# Altium project console_mainboard.PrjPcb
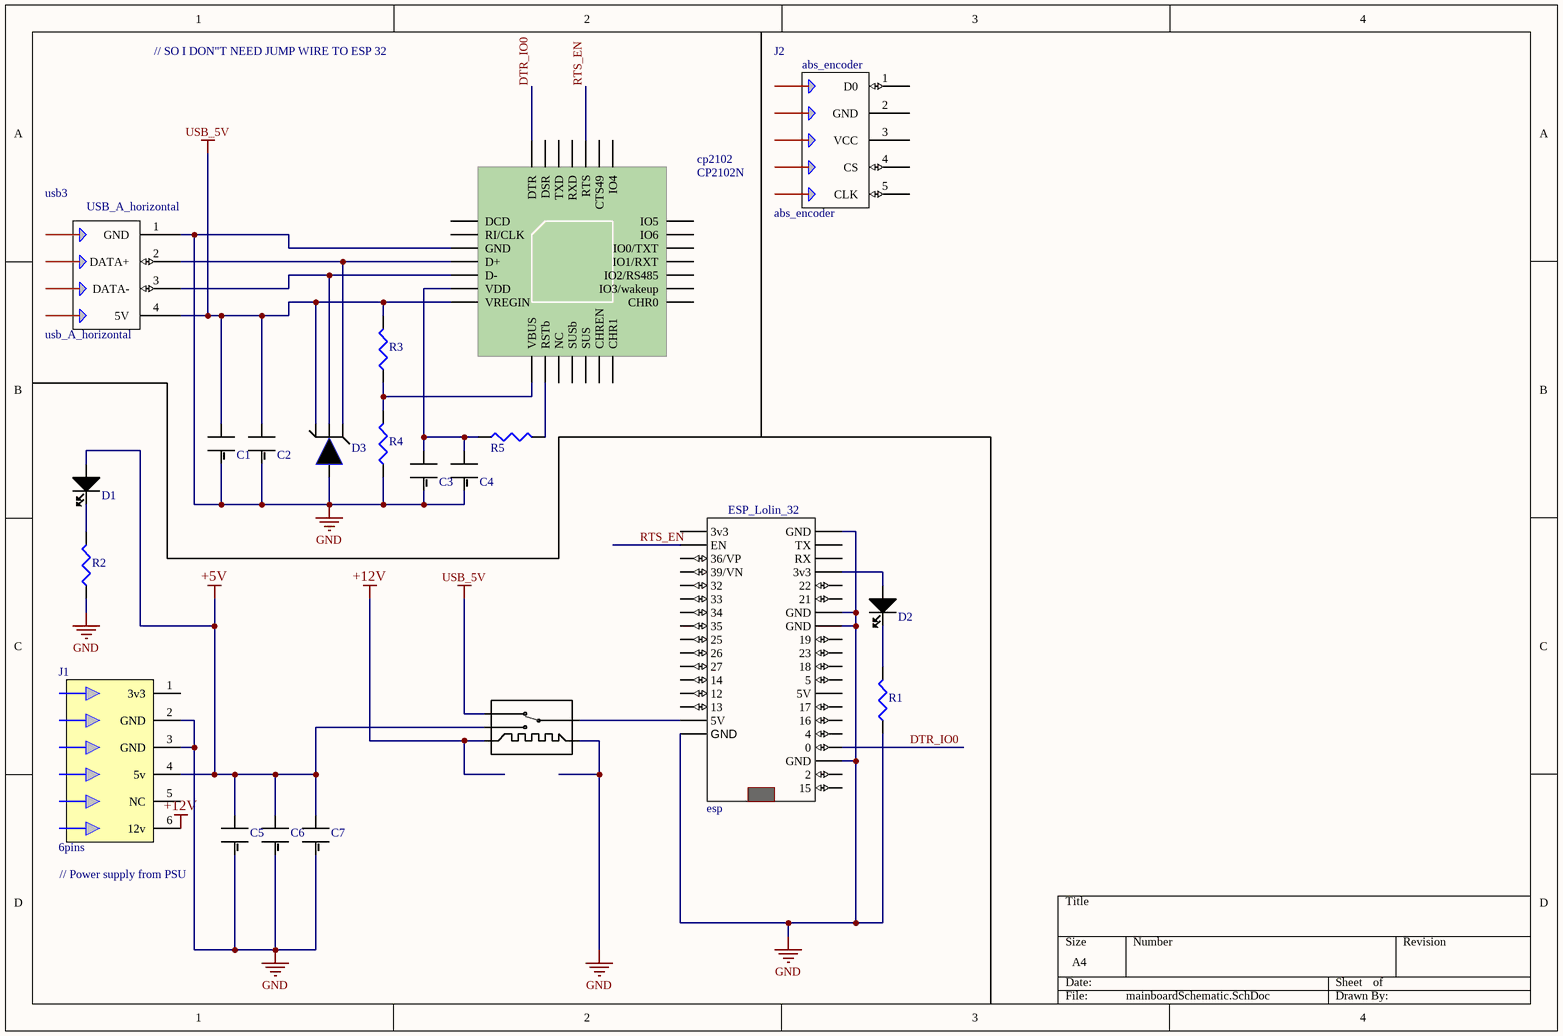
[diagram p0: mainboardSchematic.SchDoc]
1 sheet, 21 parts. Net scope: global (net labels, ports and power ports of the same name join across sheets).
Board file: MainFuckingBoard.PcbDoc

## Sheet mainboardSchematic.SchDoc
size A4

### Parts
C1  capacitor0603  [Capacitor0603]  (value not drawn)
C2  capacitor0603  [Capacitor0603]  (value not drawn)
C3  capacitor0603  [Capacitor0603]  (value not drawn)
C4  capacitor0603  [Capacitor0603]  (value not drawn)
C5  EEU-FM0J331  [2.5mmCapacitor]  (value not drawn)
C6  EEU-FM0J331  [2.5mmCapacitor]  (value not drawn)
C7  EEU-FM0J331  [2.5mmCapacitor]  (value not drawn)
cp2102  CP2102N  [CP2102N_QFN28]
D1  Led  [LED0603]  (value not drawn)
D2  Led  [LED0603]  (value not drawn)
D3  SP0503BAHTG  [SP0503BAHTG - SOT143-4]  (value not drawn)
esp  processor  [ESP_32_socket]  (value not drawn)
J1  6pins  [4.2mm 6pin power connector]
J2  abs_encoder  [xh 2.54 5 pin]
R1  360R  [R0805]  (value not drawn)
R2  360R  [R0805]  (value not drawn)
R3  22.1k  [R0805]  (value not drawn)
R4  47.5k  [R0805]  (value not drawn)
R5  1Kohms  [R0805]  (value not drawn)
Relay?  LM1H-12D  [Relay LM1H-12D]  (value not drawn)
usb3  usb_A_horizontal  [HORIZONTAL_USB_A_MALE_SOCKET]

### Nets
+5V: C5.2(+) C6.2(+) C7.2(+) D1.2 J1.4(5v) Relay?.4(NO)
+12V: J1.6(12v) Relay?.1(Coli_A)
GND: C1.1(-) C2.1(-) C3.1(-) C4.1(-) C5.1(-) C6.1(-) C7.1(-) cp2102.3(GND) D3.1(+) esp.1(GND) esp.7(GND) esp.8(GND) esp.18(GND) esp.36(GND) J1.2(GND) J1.3(GND) R1.1 R2.1 R4.1 Relay?.2(Coli_B) usb3.1(GND)
USB_5V: C1.2(+) C2.2(+) cp2102.7(VREGIN) D3.4 R3.2 Relay?.5(NC) usb3.4(5V)
DTR_IO0: cp2102.28(DTR) esp.17(0)
RTS_EN: cp2102.24(RTS) esp.22(EN)
NetC3_2: C3.2(+) C4.2(+) cp2102.6(VDD) R5.1
Netcp2102_4: cp2102.4(D+) D3.2 usb3.2(DATA+)
Netcp2102_5: cp2102.5(D-) D3.3 usb3.3(DATA-)
Netcp2102_8: cp2102.8(VBUS) R3.1 R4.2
Netcp2102_9: cp2102.9(RSTb) R5.2
NetD1_1: D1.1 R2.2
NetD2_1: D2.1 R1.2
NetD2_2: D2.2 esp.4(3v3)
Netesp_35: esp.35(5V) Relay?.3(COM)

Not connected (* = marked no-connect by the designer): cp2102 1(DCD) 2(RI/CLK) 10(NC) 11(SUSb) 12(SUS) 13(CHREN) 14(CHR1) 15(CHR0) 16(IO3/wakeup) 17(IO2/RS485) 18(IO1/RXT) 19(IO0/TXT) 20(IO6) 21(IO5) 22(IO4) 23(CTS49) 25(RXD) 26(TXD) 27(DSR); esp 2(TX) 3(RX) 5(22) 6(21) 9(19) 10(23) 11(18) 12(5) 13(5V) 14(17) 15(16) 16(4) 19(2) 20(15) 21(3v3) 23(36/VP) 24(39/VN) 25(32) 26(33) 27(34) 28(35) 29(25) 30(26) 31(27) 32(14) 33(12) 34(13); J1 1(3v3) 5(NC); J2 1(D0) 2(GND) 3(VCC) 4(CS) 5(CLK)

### Notes on the sheet
- // SO I DON"T NEED JUMP WIRE TO ESP 32
- // Power supply from PSU
- (in symbol ESP_32_lolin) ESP_Lolin_32
- (in symbol usb_A_horizontal) USB_A_horizontal

### Library data of the parts
C1-C4 = capacitor0603: Cap Ceramic 4.7uF 6.3V X5R 20% Pad SMD 0402 85C T/R; Manufacturer 1: Murata; Manufacturer Part Number 1: GRM155R60J475ME87J; Supplier 1: Digi-Key; RoHS: No; Category: Ceramic Capacitors; Stock 1: 206568; Pricing 1: 1=0.16000, 10=0.11100, 50=0.06280, 100=0.05210, 500=0.03654, 1000=0.03025, 2500=0.02815, 5000=0.02575 (USD); Capacitance: 4.7uF; Tolerance: 20%; Dielectric: X5R; Voltage Rating (DC): 6.3V; Length: 1mm; Thickness: 500um; Width: 500um; ComponentLink1URL: https://search.murata.co.jp/Ceramy/image/img/A01X/G101/ENG/GRM155R60J475ME87-01.pdf?src-supplier=Digi-Key; ComponentLink1Description: https://search.murata.co.jp/Ceramy/image/img/A01X/G101/ENG/GRM155R60J475ME87-01.pdf?src-supplier=Digi-Key; Supplier Part Number 1: 490-18211-1-ND
C5-C7 = EEU-FM0J331: Cap 330 uF;  Tol 20%;  Vol-Rtg 6.3 VDC;  Radial;  6.3x11.2;  Bulk; Manufacturer 1: Panasonic; Dielectric Material: Aluminium; Ripple Current (AC): 455mA; Capacitance: 330uF; Voltage Rating: 6.3V; Impedance: 130mR; Life (Hours): 2000Hour; Leakage Current: 10nA; Lead Length: 17mm; Lead Diameter: 0.5mm; Outside Diameter: 6mm; Supplier 1: Digi-Key; Manufacturer Part Number 1: EEU-FM0J331; RoHS: Yes; Category: Aluminum Electrolytic Capacitors; Stock 1: 15455; Pricing 1: 1=0.30000, 10=0.21200, 50=0.14800, 100=0.12690, 500=0.09518, 1000=0.08037, 2500=0.07614, 5000=0.07191 (USD); Mount: Through Hole,PCB; Case/Package: Radial; Number of Pins: 2; Min Operating Temperature: -40°C; Max Operating Temperature: 105°C; Packaging: Bulk; Tolerance: 20%; Ripple Current: 455mA; Package Quantity: 200; ESR (Equivalent Series Resistance): 130mR; Voltage Rating (DC): 6.3V; Termination: Radial; Voltage: 6.3V; Diameter: 6mm; Length: 11.2mm; Height: 11.2mm; Lead Pitch: 2.5mm; Height - Seated (Max): 0.5inch; Radiation Hardening: No; Lead Free: Lead Free; REACH SVHC: No SVHC; ComponentLink1URL: https://datasheet.ciiva.com/11778/0900766b805f3abe-11778876.pdf?src-supplier=RSComponents; ComponentLink1Description: https://datasheet.ciiva.com/11778/0900766b805f3abe-11778876.pdf?src-supplier=RSComponents; ComponentLink2URL: https://datasheet.ciiva.com/92/aba0000ce108-92408.pdf?src-supplier=Digi-Key; ComponentLink2Description: https://datasheet.ciiva.com/92/aba0000ce108-92408.pdf?src-supplier=Digi-Key; ComponentLink3URL: https://datasheet.ciiva.com/30086/aba0000ce108-30086253.pdf?src-supplier=Onlinecomponents.com; ComponentLink3Description: https://datasheet.ciiva.com/30086/aba0000ce108-30086253.pdf?src-supplier=Onlinecomponents.com; ComponentLink4URL: https://datasheet.ciiva.com/16432/aba0000ce108-16432949.pdf?src-supplier=Future+Electronics; ComponentLink4Description: https://datasheet.ciiva.com/16432/aba0000ce108-16432949.pdf?src-supplier=Future+Electronics; ComponentLink5URL: https://datasheet.ciiva.com/46441/26036-46441017.pdf?src-supplier=Element14; ComponentLink5Description: https://datasheet.ciiva.com/46441/26036-46441017.pdf?src-supplier=Element14; ComponentLink6URL: https://datasheet.ciiva.com/14608/70068540-14608622.pdf?src-supplier=Allied+Electronics; ComponentLink6Description: https://datasheet.ciiva.com/14608/70068540-14608622.pdf?src-supplier=Allied+Electronics; Supplier Part Number 1: P12918-ND
cp2102 = CP2102N-A02-GQFN28R: Full Speed USB to UART Bridge USB 2.0 3.3V T/R Automotive 28-Pin QFN EP; Manufacturer 1: Silicon Labs; Supplier 1: Digi-Key; Manufacturer Part Number 1: CP2102N-A02-GQFN28R; RoHS: No; Stock 1: 1682; Pricing 1: 1=1.40000, 25=1.35160, 100=1.29950 (USD); Supplier Part Number 1: 336-5890-1-ND
D1 D2 = LTST-C190TBKT: LED BLUE CLEAR CHIP SMD; Manufacturer 1: Vishay Lite-On; Lens Color: Colorless; Viewing Angle: 130°; Forward Voltage: 3.8V; Lens Style: Diffused,Colorless,Clear,Rectangular; Luminous Intensity: 180mcd; Forward Current: 20mA; Dominant Wavelength: 475nm; Number of Elements: 1; Power Dissipation: 76mW; Wavelength: 468nm; Reverse Voltage: 5V; Supplier 1: Digi-Key; Manufacturer Part Number 1: LTST-C190TBKT; RoHS: Yes; Category: LEDs; Stock 1: 76203; Pricing 1: 1=0.50000, 10=0.35600, 100=0.15840, 500=0.11088, 1000=0.09108 (USD); Mount: Surface Mount; Case/Package: 0603; Number of Pins: 2; Color: Blue; Case Code (Metric): 1608; Case Code (Imperial): 0603; Min Operating Temperature: -20°C; Max Operating Temperature: 80°C; Packaging: Tape and Reel; Package Quantity: 1; Illumination Color: Blue; Test Current: 20mA; Lens Transparency: Clear; Number of LEDs: 1; Length: 1.6mm; Height: 0.8mm; Width: 0.8mm; Depth: 0.8mm; Radiation Hardening: No; Lead Free: Lead Free; ComponentLink1URL: https://datasheet.ciiva.com/16353/lite-on20ltst-c190tbkt-16353409.pdf?src-supplier=Future+Electronics; ComponentLink1Description: https://datasheet.ciiva.com/16353/lite-on20ltst-c190tbkt-16353409.pdf?src-supplier=Future+Electronics; ComponentLink2URL: https://datasheet.ciiva.com/15117/getdatasheetpartid-131310-15117667.pdf?src-supplier=Verical; ComponentLink2Description: https://datasheet.ciiva.com/15117/getdatasheetpartid-131310-15117667.pdf?src-supplier=Verical; ComponentLink3URL: https://datasheet.ciiva.com/2110/ltst-c190tbkt-2110473.pdf?src-supplier=Digi-Key; ComponentLink3Description: https://datasheet.ciiva.com/2110/ltst-c190tbkt-2110473.pdf?src-supplier=Digi-Key; ComponentLink4URL: https://datasheet.ciiva.com/12400/lite-on-ltst-c190tbkt-187381-12400873.pdf?src-supplier=Mouser; ComponentLink4Description: https://datasheet.ciiva.com/12400/lite-on-ltst-c190tbkt-187381-12400873.pdf?src-supplier=Mouser; ComponentLink5URL: https://datasheet.ciiva.com/11774/0900766b80dc02ab-11774378.pdf?src-supplier=RSComponents; ComponentLink5Description: https://datasheet.ciiva.com/11774/0900766b80dc02ab-11774378.pdf?src-supplier=RSComponents; ComponentLink6URL: https://datasheet.ciiva.com/26913/ltst-c190tbkt-26913716.pdf?src-supplier=IIIC; ComponentLink6Description: https://datasheet.ciiva.com/26913/ltst-c190tbkt-26913716.pdf?src-supplier=IIIC; ComponentLink7URL: https://datasheet.ciiva.com/2110/s-110-ltst-c190tbkt0630-2110475.pdf?src-supplier=Digi-Key; ComponentLink7Description: https://datasheet.ciiva.com/2110/s-110-ltst-c190tbkt0630-2110475.pdf?src-supplier=Digi-Key; ComponentLink8Description: 橘色的; ComponentLink8URL: https://www.digikey.tw/product-detail/zh/lite-on-inc/LTST-C191KFKT/160-1445-1-ND/386832
D3 = SP0503BAHTG: ESD Suppressor TVS 5.5V 4-Pin(3+Tab) SOT-143 T/R; Manufacturer 1: Littelfuse; Element Configuration: Common Anode; Direction: Unidirectional; Capacitance: 30pF; Number of Channels: 3; Clamping Voltage: 8.5V; Power Line Protection: No; Polarity: Bidirectional,Unidirectional; Max Power Dissipation: 225mW; ESD Protection: Yes; Max Reverse Leakage Current: 100nA; Voltage Rating (DC): 5V; Diode Type: Avalanche; Supplier 1: Digi-Key; Manufacturer Part Number 1: SP0503BAHTG; RoHS: Yes; Category: Diodes; Stock 1: 63906; Pricing 1: 1=0.80000, 10=0.66000, 100=0.51120, 500=0.38340, 1000=0.30885 (USD); Mount: Surface Mount; Case/Package: SOT-143; Number of Pins: 4; Min Operating Temperature: -40°C; Max Operating Temperature: 85°C; Operating Supply Voltage: 5.5V; Packaging: Tape and Reel; Number of Unidirectional Channels: 3; Reverse Standoff Voltage: 5.5V; Breakdown Voltage: 5.5V; Termination: SMD/SMT; Working Voltage: 5.5V; Peak Pulse Power: 225mW; Leakage Current: 100nA; Number of Elements: 3; Power Dissipation: 225mW; Resistor Type: Zener; Length: 3.04mm; Height: 1.05mm; Width: 1.4mm; Depth: 1.4mm; Radiation Hardening: No; REACH SVHC: No SVHC; Lead Free: Lead Free; ComponentLink1URL: https://datasheet.ciiva.com/15143/getdatasheetpartid-116020-15143550.pdf?src-supplier=Verical; ComponentLink1Description: https://datasheet.ciiva.com/15143/getdatasheetpartid-116020-15143550.pdf?src-supplier=Verical; ComponentLink2URL: https://datasheet.ciiva.com/332/sp05xxba-332550.pdf?src-supplier=Digi-Key; ComponentLink2Description: https://datasheet.ciiva.com/332/sp05xxba-332550.pdf?src-supplier=Digi-Key; ComponentLink3URL: https://datasheet.ciiva.com/8062/littefuse-spa-sp050x-8062422.pdf?src-supplier=Element14; ComponentLink3Description: https://datasheet.ciiva.com/8062/littefuse-spa-sp050x-8062422.pdf?src-supplier=Element14; ComponentLink4URL: https://datasheet.ciiva.com/22697/1911798-22697942.pdf?src-supplier=Element14; ComponentLink4Description: https://datasheet.ciiva.com/22697/1911798-22697942.pdf?src-supplier=Element14; ComponentLink5URL: https://datasheet.ciiva.com/332/sp05xxba-332551.pdf?src-supplier=Digi-Key; ComponentLink5Description: https://datasheet.ciiva.com/332/sp05xxba-332551.pdf?src-supplier=Digi-Key; ComponentLink6URL: https://datasheet.ciiva.com/16449/sp05xxba-16449463.pdf?src-supplier=Future+Electronics; ComponentLink6Description: https://datasheet.ciiva.com/16449/sp05xxba-16449463.pdf?src-supplier=Future+Electronics; ComponentLink7URL: https://datasheet.ciiva.com/332/sp05xxba-332552.pdf?src-supplier=Digi-Key; ComponentLink7Description: https://datasheet.ciiva.com/332/sp05xxba-332552.pdf?src-supplier=Digi-Key; ComponentLink8URL: https://datasheet.ciiva.com/4509/sp05x-leadfree-4509162.pdf?src-supplier=Mouser; ComponentLink8Description: https://datasheet.ciiva.com/4509/sp05x-leadfree-4509162.pdf?src-supplier=Mouser; ComponentLink9URL: https://datasheet.ciiva.com/7650/526672-7650894.pdf?src-supplier=Element14; ComponentLink9Description: https://datasheet.ciiva.com/7650/526672-7650894.pdf?src-supplier=Element14; Supplier Part Number 1: F2715CT-ND
esp = ESP_32_lolin
J1 = 4.2mm 6pin module connector: MiniFit Jr RA Hdr Assy LCP 6 w/press pgs; Manufacturer 1: Molex; Current Rating: 13A; Voltage Rating: 600V; Number of Positions: 6; Pitch: 4.2mm; Supplier 1: Digi-Key; Manufacturer Part Number 1: 50-36-2462; RoHS: Yes; Category: Headers and Wire Housings; Stock 1: 3080; Pricing 1: 1=1.09000, 10=0.96100, 100=0.82900, 500=0.67824, 1000=0.60288, 5000=0.52752, 10000=0.50114 (USD); Mount: Through Hole; Number of Pins: 6; Contact Plating: Tin; Housing Material: Polymer; Material: Brass; Contact Material: Brass; Min Operating Temperature: -40°C; Max Operating Temperature: 105°C; Contact Gender: Male; Packaging: Tray; Package Quantity: 920; Number of Rows: 2; Termination: Through Hole; Orientation: Right Angle; Row Spacing: 4.2mm; Flammability Rating: UL94 V-0; REACH SVHC: No SVHC; ELV: Compliant; ComponentLink1URL: https://datasheet.ciiva.com/29142/050362462-sd-29142097.pdf?src-supplier=Digi-Key; ComponentLink1Description: https://datasheet.ciiva.com/29142/050362462-sd-29142097.pdf?src-supplier=Digi-Key; Supplier Part Number 1: WM14529-ND
J2 = Abs_encoder_pins: ComponentLink1Description: datasheet; ComponentLink1URL: http://www.jst-mfg.com/product/pdf/eng/eXH.pdf
R1 R2 = CRCW0805360RFKEA: Res Thick Film 0805 360 Ohm 1% 0.125W(1/8W) ±100ppm/C Molded SMD Automotive Paper T/R; Manufacturer 1: Vishay; Temperature Coefficient: 100ppm/°C; Max Power Dissipation: 125mW; Voltage Rating (DC): 150V; Supplier 1: Digi-Key; Manufacturer Part Number 1: CRCW0805360RFKEA; RoHS: Yes; Category: Chip SMD Resistors; Stock 1: 25005; Pricing 1: 1=0.10000, 10=0.06000, 100=0.02450, 1000=0.01102, 2500=0.00957 (USD); Case/Package: 0805; Number of Pins: 2; Weight: 0.000194oz; Case Code (Metric): 2012; Case Code (Imperial): 0805; Contact Plating: Tin; Number of Terminals: 2; Min Operating Temperature: -55°C; Max Operating Temperature: 155°C; Resistance: 360R; Tolerance: 1%; Packaging: Tape and Reel; Composition: Thick Film; Package Quantity: 10; Number of Terminations: 2; Features: Automotive AEC-Q200; Power Rating: 125mW; Voltage Rating: 150V; Termination: SMD/SMT; Military Standard: Not; Length: 2mm; Height: 0.45mm; Width: 0.049inch; Depth: 1.25mm; Radiation Hardening: No; Lead Free: Lead Free; REACH SVHC: Unknown; ComponentLink1URL: https://datasheet.ciiva.com/2467/dcrcwe3-2467773.pdf?src-supplier=Digi-Key; ComponentLink1Description: https://datasheet.ciiva.com/2467/dcrcwe3-2467773.pdf?src-supplier=Digi-Key; Supplier Part Number 1: 541-360CCT-ND
R3 R4 = resistor(CRCW0805360RFKEA: Res Thick Film 0805 360 Ohm 1% 0.125W(1/8W) ±100ppm/C Molded SMD Automotive Paper T/R; Manufacturer 1: Vishay; Resistance: 360R; Temperature Coefficient: 100ppm/°C; Max Power Dissipation: 125mW; Voltage Rating (DC): 150V; Supplier 1: Digi-Key; Manufacturer Part Number 1: CRCW0805360RFKEA; RoHS: Yes; Category: Chip SMD Resistors; Stock 1: 25005; Pricing 1: 1=0.10000, 10=0.06000, 100=0.02450, 1000=0.01102, 2500=0.00957 (USD); Case/Package: 0805; Number of Pins: 2; Weight: 0.000194oz; Case Code (Metric): 2012; Case Code (Imperial): 0805; Contact Plating: Tin; Number of Terminals: 2; Min Operating Temperature: -55°C; Max Operating Temperature: 155°C; Tolerance: 1%; Packaging: Tape and Reel; Composition: Thick Film; Package Quantity: 10; Number of Terminations: 2; Features: Automotive AEC-Q200; Power Rating: 125mW; Voltage Rating: 150V; Termination: SMD/SMT; Military Standard: Not; Length: 2mm; Height: 0.45mm; Width: 0.049inch; Depth: 1.25mm; Radiation Hardening: No; Lead Free: Lead Free; REACH SVHC: Unknown; ComponentLink1URL: https://datasheet.ciiva.com/2467/dcrcwe3-2467773.pdf?src-supplier=Digi-Key; ComponentLink1Description: https://datasheet.ciiva.com/2467/dcrcwe3-2467773.pdf?src-supplier=Digi-Key; Supplier Part Number 1: 541-360CCT-ND
R5 = resistor(CRCW0805360RFKEA: Manufacturer 1: Vishay; Resistance: 360R; Tolerance: 1%; Temperature Coefficient: 100ppm/°C; Max Power Dissipation: 125mW; Voltage Rating (DC): 150V; Supplier 1: Digi-Key; Manufacturer Part Number 1: CRCW0805360RFKEA; RoHS: Yes; Category: Chip SMD Resistors; Stock 1: 25005; Pricing 1: 1=0.10000, 10=0.06000, 100=0.02450, 1000=0.01102, 2500=0.00957 (USD); Case/Package: 0805; Number of Pins: 2; Weight: 0.000194oz; Case Code (Metric): 2012; Case Code (Imperial): 0805; Contact Plating: Tin; Number of Terminals: 2; Min Operating Temperature: -55°C; Max Operating Temperature: 155°C; Packaging: Tape and Reel; Composition: Thick Film; Package Quantity: 10; Number of Terminations: 2; Features: Automotive AEC-Q200; Power Rating: 125mW; Voltage Rating: 150V; Termination: SMD/SMT; Military Standard: Not; Length: 2mm; Height: 0.45mm; Width: 0.049inch; Depth: 1.25mm; Radiation Hardening: No; Lead Free: Lead Free; REACH SVHC: Unknown; ComponentLink1URL: https://datasheet.ciiva.com/2467/dcrcwe3-2467773.pdf?src-supplier=Digi-Key; ComponentLink1Description: https://datasheet.ciiva.com/2467/dcrcwe3-2467773.pdf?src-supplier=Digi-Key; Supplier Part Number 1: 541-360CCT-ND
usb3 = usb_A_horizontal: 4 Position Single Port Socket Right Angle Type A Through Hole USB; Manufacturer 1: TE Connectivity; Manufacturer Part Number 1: 292303-1; Plating: Bright,Tin; Current Rating: 1A; Voltage Rating (AC): 30V; Gender: Receptacle; Number of Ports: 1; Insulation Resistance: 1GR; Number of Contacts: 4; Plating Thickness: 0.76um; USB Standard: USB 2.0; Circuit Application: Signal; Connector System: Cable-to-Board; PCB Thickness: 0.062inch; Tail Length: 0.112inch; Pitch: 2.5mm; Approvals: UL; Supplier 1: Digi-Key; RoHS: Yes; Category: Audio / Video Connectors; Stock 1: 16277; Pricing 1: 1=1.49000, 10=1.35400, 25=1.27160, 50=1.21620, 100=1.16100, 250=1.05040, 500=0.96748, 1000=0.82926, 2500=0.77398 (USD); Mount: Through Hole,Horizontal; Contact Plating: Gold; Contact Material: Copper Alloy,Copper; Color: Black; Number of Terminals: 4; Housing Material: Thermoplastic; Housing Color: Black; Min Operating Temperature: -67°C; Max Operating Temperature: 185°C; Packaging: Rail/Tube; Package Quantity: 30; Connector Type: Receptacle; Termination: Through Hole; Number of Positions: 4; Orientation: Right Angle; Contact Current Rating: 1A; Length: 14.63mm; Depth: 14mm; REACH SVHC: No SVHC; Flammability Rating: UL94 V-0; Halogen Free: Halogen Free; ComponentLink1URL: https://datasheet.ciiva.com/851/eng-cd-292303-e9-851601.pdf?src-supplier=Farnell; ComponentLink1Description: https://datasheet.ciiva.com/851/eng-cd-292303-e9-851601.pdf?src-supplier=Farnell; ComponentLink2URL: https://datasheet.ciiva.com/1099/1653030-1099765.pdf?src-supplier=Newark; ComponentLink2Description: https://datasheet.ciiva.com/1099/1653030-1099765.pdf?src-supplier=Newark; ComponentLink3URL: https://datasheet.ciiva.com/1098/eng-cd-292303-e9-1098298.pdf?src-supplier=Element14; ComponentLink3Description: https://datasheet.ciiva.com/1098/eng-cd-292303-e9-1098298.pdf?src-supplier=Element14; ComponentLink4URL: https://datasheet.ciiva.com/11731/0900766b806d08c4-11731322.pdf?src-supplier=RSComponents; ComponentLink4Description: https://datasheet.ciiva.com/11731/0900766b806d08c4-11731322.pdf?src-supplier=RSComponents; ComponentLink5URL: https://datasheet.ciiva.com/14103/04270708-14103420.pdf?src-supplier=Distrelec; ComponentLink5Description: https://datasheet.ciiva.com/14103/04270708-14103420.pdf?src-supplier=Distrelec; ComponentLink6URL: https://datasheet.ciiva.com/19454/921651-19454494.pdf?src-supplier=Jameco; ComponentLink6Description: https://datasheet.ciiva.com/19454/921651-19454494.pdf?src-supplier=Jameco; ComponentLink7URL: https://datasheet.ciiva.com/16308/eng-cd-292303-e7-16308319.pdf?src-supplier=Future+Electronics; ComponentLink7Description: https://datasheet.ciiva.com/16308/eng-cd-292303-e7-16308319.pdf?src-supplier=Future+Electronics; ComponentLink8URL: https://datasheet.ciiva.com/3094/eng-ds-1-1773453-6-0908-3094357.pdf?src-supplier=Avnet; ComponentLink8Description: https://datasheet.ciiva.com/3094/eng-ds-1-1773453-6-0908-3094357.pdf?src-supplier=Avnet; ComponentLink9URL: https://datasheet.ciiva.com/16468/eng-ds-1-1773453-6-0908-16468232.pdf?src-supplier=Avnet+Asia; ComponentLink9Description: https://datasheet.ciiva.com/16468/eng-ds-1-1773453-6-0908-16468232.pdf?src-supplier=Avnet+Asia; ComponentLink10URL: https://datasheet.ciiva.com/851/eng-cd-292303-e9-851082.pdf?src-supplier=Digi-Key; ComponentLink10Description: https://datasheet.ciiva.com/851/eng-cd-292303-e9-851082.pdf?src-supplier=Digi-Key; ComponentLink11URL: https://datasheet.ciiva.com/8016/1653030-8016986.pdf?src-supplier=Element14; ComponentLink11Description: https://datasheet.ciiva.com/8016/1653030-8016986.pdf?src-supplier=Element14; ComponentLink12URL: https://datasheet.ciiva.com/14618/70041246-14618698.pdf?src-supplier=Allied+Electronics; ComponentLink12Description: https://datasheet.ciiva.com/14618/70041246-14618698.pdf?src-supplier=Allied+Electronics; ComponentLink13URL: https://datasheet.ciiva.com/25907/eng-ds-1-1773453-6-0908-25907515.pdf?src-supplier=Avnet+Europe; ComponentLink13Description: https://datasheet.ciiva.com/25907/eng-ds-1-1773453-6-0908-25907515.pdf?src-supplier=Avnet+Europe; ComponentLink14URL: https://datasheet.ciiva.com/30148/ddecontrolleractionsrchrtrvdocnm117734536doctypedsdoclan-30148862.pdf?src-supplier=Onlinecomponents.com; ComponentLink14Description: https://datasheet.ciiva.com/30148/ddecontrolleractionsrchrtrvdocnm117734536doctypedsdoclan-30148862.pdf?src-supplier=Onlinecomponents.com; Supplier Part Number 1: A31726-ND